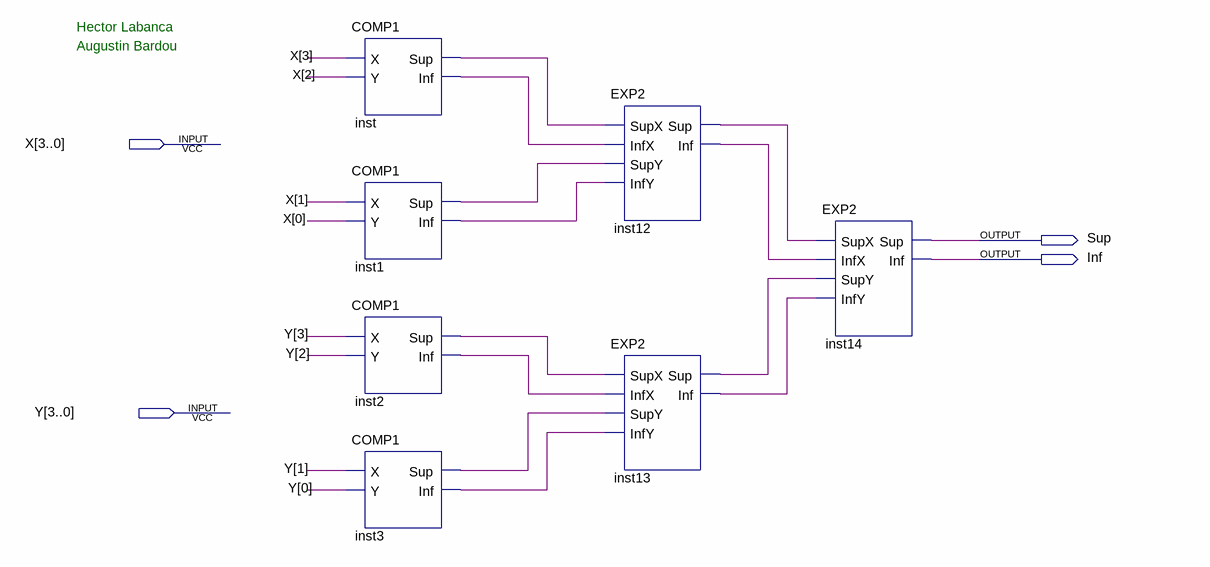
[diagram p0: schematic sheet]
// Quartus schematic COMP4.bdf as structural Verilog: 7 symbols, 4 pins
module COMP4 (
  input  [3:0] X,
  input  [3:0] Y,
  output Sup,
  output Inf
);

  wire inst1_inf, inst1_sup, inst2_inf, inst2_sup, inst3_inf, inst3_sup, inst12_inf, inst12_sup, inst13_inf,
       inst13_sup, inst_inf, inst_sup;

  COMP1 inst (.X(X[3]), .Y(X[2]), .Sup(inst_sup), .Inf(inst_inf));
  COMP1 inst1 (.X(X[1]), .Y(X[0]), .Sup(inst1_sup), .Inf(inst1_inf));
  COMP1 inst2 (.X(Y[3]), .Y(Y[2]), .Sup(inst2_sup), .Inf(inst2_inf));
  COMP1 inst3 (.X(Y[1]), .Y(Y[0]), .Sup(inst3_sup), .Inf(inst3_inf));
  EXP2 inst12 (
    .SupX(inst_sup), .InfX(inst_inf), .SupY(inst1_sup), .InfY(inst1_inf), .Sup(inst12_sup), .Inf(inst12_inf));
  EXP2 inst13 (
    .SupX(inst2_sup), .InfX(inst2_inf), .SupY(inst3_sup), .InfY(inst3_inf), .Sup(inst13_sup), .Inf(inst13_inf));
  EXP2 inst14 (.SupX(inst12_sup), .InfX(inst12_inf), .SupY(inst13_sup), .InfY(inst13_inf), .Sup(Sup), .Inf(Inf));

  // Notes on the sheet:
  //   Hector Labanca
  //   Augustin Bardou
endmodule
